# Altium schematic sheet RFD900X Holder.SchDoc
size A3; Revision: 7
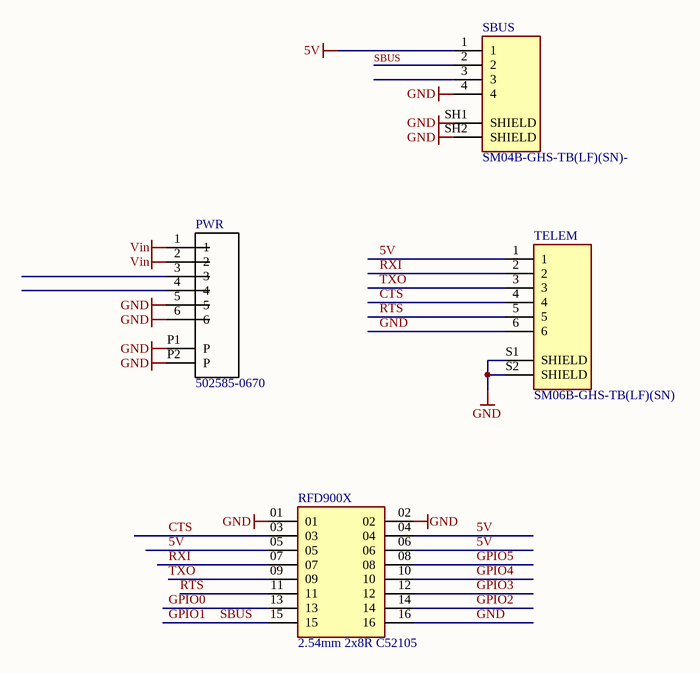
[diagram p0: RFD900X Holder.SchDoc]

## Parts
PWR  502585-0670  [MOLEX_502585-0670]
RFD900X  2.54mm 2x8R C52105  [2.54mm 2x8R]
SBUS  SM04B-GHS-TB(LF)(SN)-  [JST_SM04B-GHS-TB(LF)(SN)-]
TELEM  SM06B-GHS-TB(LF)(SN)  [JST_SM06B-GHS-TB(LF)(SN)]

## Nets
5V: RFD900X.04 RFD900X.05 RFD900X.06 SBUS.1 TELEM.1
GND: PWR.5 PWR.6 PWR.P1(P) PWR.P2(P) RFD900X.01 RFD900X.02 RFD900X.16 SBUS.4 SBUS.SH1(SHIELD) SBUS.SH2(SHIELD) TELEM.6 TELEM.S1(SHIELD) TELEM.S2(SHIELD)
Vin: PWR.1 PWR.2
CTS: RFD900X.03 TELEM.4
GPIO0: RFD900X.13
GPIO1: RFD900X.15 SBUS.2  [also labelled SBUS]
GPIO2: RFD900X.14
GPIO3: RFD900X.12
GPIO4: RFD900X.10
GPIO5: RFD900X.08
RTS: RFD900X.11 TELEM.5
RXI: RFD900X.07 TELEM.2
TXO: RFD900X.09 TELEM.3

Not connected (* = marked no-connect by the designer): PWR 3 4; SBUS 3

## Library data of the parts
PWR = 502585-0670: 1.50mm Pitch, CLIK-Mate PCB Receptacle, Single Row, Surface Mount, Right-Angle, Tin Plating, Positive Lock, 6 Circuits, Natural; MF: Molex; System: Connector; MP: 502585-0670; Package: None; SnapEDA_Link: https://www.snapeda.com/parts/502494-0670/Molex/view-part/?ref=snap; Value: *; Type: SMD
RFD900X = 2.54mm 2x8R C52105: MF: BOOMELE; Package: None; Value: *; MP: C52105; HelpURL: https://item.szlcsc.com/53119.html
SBUS = SM04B-GHS-TB(LF)(SN)-: Connector Header Surface Mount, Right Angle 4 position 0.049 _1.25mm_; MF: JST Sales; MP: SM04B-GHS-TB(LF)(SN); Package: None; Value: *; SnapEDA_Link: https://www.snapeda.com/parts/SM04B-GHS-TB%28LF%29%28SN%29-/JST%20Sales%20America%20Inc./view-part/2759740/?ref=snap; HelpURL: http://www.farnell.com/datasheets/2082975.pdf; System: Connector; ChipDip_Link: https://www.chipdip.ru/product/sm04b-ghs-tb-lf-sn-gh-1.25mm-header-side-ent
TELEM = SM06B-GHS-TB(LF)(SN): Connector Header Surface Mount, Right Angle 6 position 0.049" (1.25mm); MP: SM06B-GHS-TB_LF__SN_; MF: JST Sales; Value: *; Package: None; Price: None; Availability: Unavailable; SnapEDA_Link: https://www.snapeda.com/parts/SM06B-GHS-TB%28LF%29%28SN%29/JST%20Sales%20America%20Inc./view-part/817690/?ref=snap; HelpURL: http://www.farnell.com/datasheets/2082975.pdf; System: Connector; ChipDip_Link: https://www.chipdip.ru/product1/8002005407